# Altium project Master board.PrjPcb
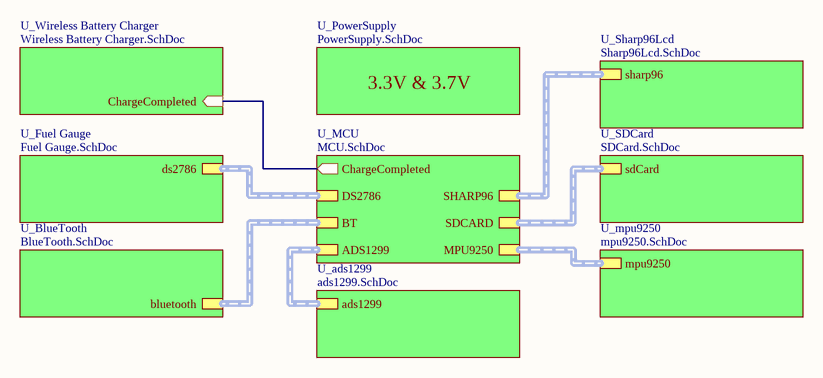
[diagram p0: Top Layer.SchDoc]
10 sheets, 102 parts. Net scope: hierarchical (ports join the sheet entries above them; power ports are global).
Board file: ArrowMasterBoard.PcbDoc
Sheets:
  Top Layer.SchDoc
    U_Wireless Battery Charger = Wireless Battery Charger.SchDoc
    U_Fuel Gauge = Fuel Gauge.SchDoc
    U_PowerSupply = PowerSupply.SchDoc
    U_MCU = MCU.SchDoc
    U_BlueTooth = BlueTooth.SchDoc
    U_mpu9250 = mpu9250.SchDoc
    U_SDCard = SDCard.SchDoc
    U_Sharp96Lcd = Sharp96Lcd.SchDoc
    U_ads1299 = ads1299.SchDoc

## Sheet Top Layer.SchDoc
size A4

### Sub-sheets
U_ads1299 = ads1299.SchDoc: ads1299 (harness ads1299)
U_BlueTooth = BlueTooth.SchDoc: bluetooth (harness bluetooth)
U_Fuel Gauge = Fuel Gauge.SchDoc: ds2786 (harness ds2786)
U_MCU = MCU.SchDoc: ADS1299 (harness ads1299), MPU9250 (harness mpu9250), DS2786 (harness ds2786), SHARP96 (harness sharp96), SDCARD (harness sdCard), BT (harness bluetooth), ChargeCompleted (out)
U_mpu9250 = mpu9250.SchDoc: mpu9250 (harness mpu9250)
U_PowerSupply = PowerSupply.SchDoc: no entries
U_SDCard = SDCard.SchDoc: sdCard (harness sdCard)
U_Sharp96Lcd = Sharp96Lcd.SchDoc: sharp96 (harness sharp96)
U_Wireless Battery Charger = Wireless Battery Charger.SchDoc: ChargeCompleted (in)

### Nets
P4.7: sheet U_Wireless Battery Charger/ChargeCompleted, sheet U_MCU/ChargeCompleted

### Buses and harness runs
harness sheet U_ads1299/ads1299 = sheet U_MCU/ADS1299
harness sheet U_BlueTooth/bluetooth = sheet U_MCU/BT
harness sheet U_Fuel Gauge/ds2786 = sheet U_MCU/DS2786
harness sheet U_MCU/MPU9250 = sheet U_mpu9250/mpu9250
harness sheet U_MCU/SDCARD = sheet U_SDCard/sdCard
harness sheet U_MCU/SHARP96 = sheet U_Sharp96Lcd/sharp96

### Notes on the sheet
- 3.3V & 3.7V

## Sheet Wireless Battery Charger.SchDoc
size A4; PageSetup: Record=PageOptions|CenterHorizontal=True|CenterVertical=True|PrintScale=0.97|XCorrection=1.00|YCorrection=1.00|PrintKind=2|BorderSize=5000000|LeftOffset=0|BottomOffset=0|Orientation=2|PaperLength=1000|PaperWidth=1000|Scale=100|PaperSource=7|PrintQuality=-3|MediaType=1|DitherType=10|PrintScaleMode=1|PaperKind=A4|PaperIndex=9
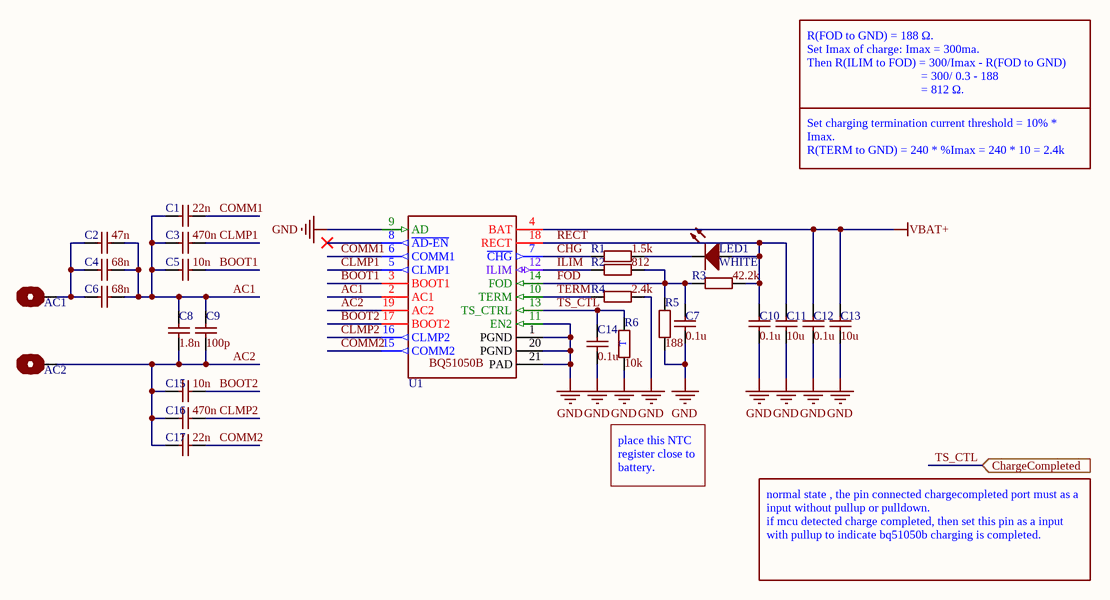
[diagram p1: Wireless Battery Charger.SchDoc]

### Parts
AC1  Pad  [PAD]  (value not drawn)
AC2  Pad  [PAD]  (value not drawn)
C1  value 22n  [C0402_h]  (hidden comment: Capacitor)
C2  value 47n  [C0402_h]  (hidden comment: Capacitor)
C3  value 470n  [C0402_h]  (hidden comment: Capacitor)
C4  value 68n  [C0402_h]  (hidden comment: Capacitor)
C5  value 10n  [C0402_h]  (hidden comment: Capacitor)
C6  value 68n  [C0402_h]  (hidden comment: Capacitor)
C7  value 0.1u  [C0402_h]  (hidden comment: Capacitor)
C8  value 1.8n  [C0402_h]  (hidden comment: Capacitor)
C9  value 100p  [C0402_h]  (hidden comment: Capacitor)
C10  value 0.1u  [C0402_h]  (hidden comment: Capacitor)
C11  value 10u  [C0402_h]  (hidden comment: Capacitor)
C12  value 0.1u  [C0402_h]  (hidden comment: Capacitor)
C13  value 10u  [C0402_h]  (hidden comment: Capacitor)
C14  value 0.1u  [C0402_h]  (hidden comment: Capacitor)
C15  value 10n  [C0402_h]  (hidden comment: Capacitor)
C16  value 470n  [C0402_h]  (hidden comment: Capacitor)
C17  value 22n  [C0402_h]  (hidden comment: Capacitor)
LED1  Color: WHITE  [LED0805]  (hidden comment: LED)
R1  value 1.5k  [R0402]  (hidden comment: Register)
R2  value 812  [R0402]  (hidden comment: Register)
R3  value 42.2k  [R0402]  (hidden comment: Register)
R4  value 2.4k  [R0402]  (hidden comment: Register)
R5  value 188  [R0402]  (hidden comment: Register)
R6  value 10k  [NTC]  (hidden comment: Register)
U1  BQ51050BRHLR  [VQFN-20]  (value not drawn)

### Ports
ChargeCompleted (in)

### Nets
GND: C7.2 C10.1 C11.1 C12.1 C13.1 C14.1 R4.2 R5.2 R6.1 U1.1(PGND) U1.9(AD) U1.11(EN2) U1.20(PGND) U1.21(PAD)
VBAT+: C12.2 C13.2 U1.4(BAT)
AC1: C1.1 C2.2 C3.1 C4.2 C5.1 C6.2 C8.2 C9.2 U1.2(AC1)
AC2: AC2.1 C8.1 C9.1 C15.1 C16.1 C17.1 U1.19(AC2)
BOOT1: C5.2 U1.3(BOOT1)
BOOT2: C15.2 U1.17(BOOT2)
CHG: R1.2 U1.7(~{CHG})
CLMP1: C3.2 U1.5(CLMP1)
CLMP2: C16.2 U1.16(CLMP2)
COMM1: C1.2 U1.6(COMM1)
COMM2: C17.2 U1.15(COMM2)
FOD: C7.1 R2.2 R3.1 R5.1 U1.14(FOD)
ILIM: R2.1 U1.12(ILIM)
RECT: C10.2 C11.2 LED1.1(A) R3.2 U1.18(RECT)
TERM: R4.1 U1.10(TERM)
TS_CTL: C14.2 R6.2 U1.13(TS_CTRL) ; port ChargeCompleted  [project net P4.7]
NetAC1_1: AC1.1 C2.1 C4.1 C6.1
NetLED1_2: LED1.2(K) R1.1

Not connected (* = marked no-connect by the designer): U1 8(~{AD-EN})*

### Notes on the sheet
- R(FOD to GND) = 188 Ω.
  Set Imax of charge: Imax = 300ma.
  Then R(ILIM to FOD) = 300/Imax - R(FOD to GND)
  = 300/ 0.3 - 188
  = 812 Ω.
- Set charging termination current threshold = 10% * Imax.
  R(TERM to GND) = 240 * %Imax = 240 * 10 = 2.4k
- place this NTC register close to battery.
- normal state , the pin connected chargecompleted port must as a input without pullup or pulldown.
  if mcu detected charge completed, then set this pin as a input with pullup to indicate bq51050b charging is completed.
- (in symbol BQ51050BRHLR) BQ51050B
- (in symbol 热敏电阻) T

### Library data of the parts
C1-C17 = 贴片电容-无极性: VDC: 10V; Published: 8-Jun-2000; LatestRevisionDate: 17-Jul-2002; LatestRevisionNote: Re-released for DXP Platform.; PackageReference: RAD-0.3; Publisher: Altium Limited; PackageDescription: Radial Cap, Thru-Hole; 2 Leads; 0.3 in Pin Spacing
R1-R5 = 贴片电阻
R6 = 热敏电阻
U1 = BQ51050BRHLR: 4.2V Li-Ion Wireless Battery Charger, receiver; Manufacturer: Texas Instruments; CompType: IC; PIN_COUNT: 21; PartNumber: BQ51050BRHLR; PackageReference: RHL0020A; MountType: SMT; RoHS: Y; RefDes: RefDes; Type: DEV; Value: Value
LED1 = LED: Published: 8-Jun-2000; LatestRevisionDate: 08-Jul-2005; LatestRevisionNote: Mech Layer 1 removed.; PackageReference: LED-0; Publisher: Altium Limited; PackageDescription: LED; 2 Leads

## Sheet Fuel Gauge.SchDoc
size A4; PageSetup: Record=PageOptions|CenterHorizontal=True|CenterVertical=True|PrintScale=0.97|XCorrection=1.00|YCorrection=1.00|PrintKind=2|BorderSize=5000000|LeftOffset=0|BottomOffset=0|Orientation=2|PaperLength=1000|PaperWidth=1000|Scale=100|PaperSource=7|PrintQuality=-3|MediaType=1|DitherType=10|PrintScaleMode=1|PaperKind=A4|PaperIndex=9
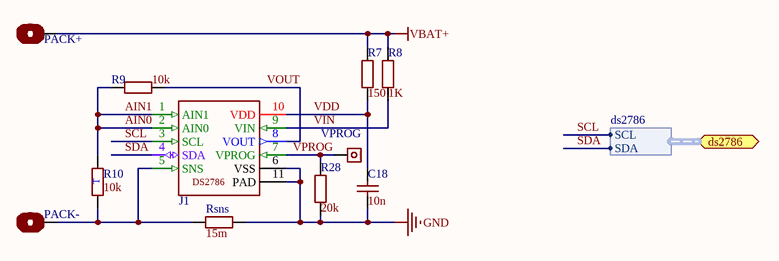
[diagram p2: Fuel Gauge.SchDoc]

### Parts
C18  value 10n  [C0402_h]  (hidden comment: Capacitor)
J1  DS2786G+  [TDFN-EP-10]  (value not drawn)
PACK+  Pad  [PAD]  (value not drawn)
PACK-  Pad  [PAD]  (value not drawn)
R7  value 150  [R0402]  (hidden comment: Register)
R8  value 1K  [R0402]  (hidden comment: Register)
R9  value 10k  [R0402]  (hidden comment: Register)
R10  value 10k  [NTC]  (hidden comment: Register)
R28  value 20k  [R0402]  (hidden comment: Register)
Rsns  value 15m  [R0805]  (hidden comment: Register)
VPROG  TestPoint  [TestPoint]  (value not drawn)

### Ports
ds2786 (harness ds2786)

### Harnesses
ds2786: SCL, SDA

### Nets
GND: C18.1 J1.6(VSS) J1.11(PAD) R28.2 Rsns.2
VBAT+: PACK+.1 R7.1 R8.1
AIN0: J1.1(AIN1) J1.2(AIN0) R9.2 R10.2  [also labelled AIN1]
SCL: J1.3(SCL) ; port ds2786.SCL  [project net MPU_SCL]
SDA: J1.4(SDA) ; port ds2786.SDA  [project net MPU_SDA]
VDD: C18.2 J1.10(VDD) R7.2
VIN: J1.9(VIN) R8.2
VOUT: J1.8(VOUT) R9.1
VPROG: J1.7(VPROG) R28.1 VPROG.1(test)
NetJ1_5: J1.5(SNS) PACK-.1 R10.1 Rsns.1

### Notes on the sheet
- (in symbol DS2786G+) DS2786
- (in symbol TestPoint) testpoint
- (in symbol 热敏电阻) T

### Library data of the parts
C18 = 贴片电容-无极性: VDC: 10V; Published: 8-Jun-2000; LatestRevisionDate: 17-Jul-2002; LatestRevisionNote: Re-released for DXP Platform.; PackageReference: RAD-0.3; Publisher: Altium Limited; PackageDescription: Radial Cap, Thru-Hole; 2 Leads; 0.3 in Pin Spacing
J1 = DS2786G+: Fuek Gauge; Voltage - Supply: 2.5 V ~ 5.5 V; Battery Type: Li-Ion, Li-Pol; Function: Fuel, Gas Gauge/Monitor; Vendor: Maxim Integrated Products; Battery Chemistry: Lithium-Ion (Li-Ion), Lithium-Polymer (Li-Pol); Packaging: Tube; Package / Case: 10-WFDFN Exposed Pad; Operating Temperature: -40??C ~ 85??C; DataSheet: http://datasheets.maxim-ic.com/en/ds/DS2786.pdf; DigiKeyPartNumber: DS2786G+-ND; Manufacturer_Part_Number: DS2786G+; Quantity_Available: 928; Mounting Type: Surface Mount; Supplier Device Package: 10-TDFN-EP (3x4); RefDes: RefDes; Type: DEV; Value: Value
R7-R9 R28 Rsns = 贴片电阻
R10 = 热敏电阻

## Sheet PowerSupply.SchDoc
size A4; PageSetup: Record=PageOptions|CenterHorizontal=True|CenterVertical=True|PrintScale=0.97|XCorrection=1.00|YCorrection=1.00|PrintKind=2|BorderSize=5000000|LeftOffset=0|BottomOffset=0|Orientation=2|PaperLength=1000|PaperWidth=1000|Scale=100|PaperSource=7|PrintQuality=-3|MediaType=1|DitherType=10|PrintScaleMode=1|PaperKind=A4|PaperIndex=9
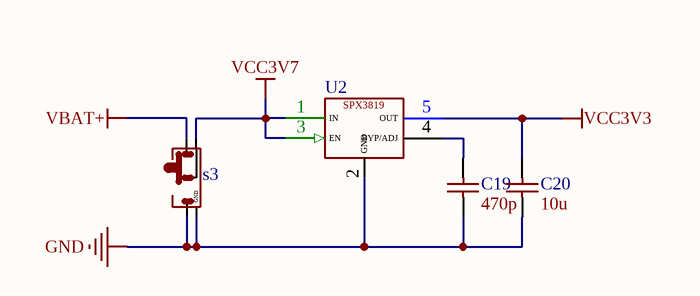
[diagram p3: PowerSupply.SchDoc]

### Parts
C19  value 470p  [C0402_h]  (hidden comment: Capacitor)
C20  value 10u  [C0402_h]  (hidden comment: Capacitor)
s3  switch  [侧动贴片开关]  (value not drawn)
U2  SPX3819  [SOT23-5]  (value not drawn)

### Nets
GND: C19.2 C20.2 s3.0(GND) s3.3(R) U2.2(GND)
VBAT+: s3.1(L)
VCC3V3: C20.1 U2.5(OUT)
VCC3V7: s3.2(mid) U2.1(IN) U2.3(EN)
NetC19_1: C19.1 U2.4(BYP/ADJ)

### Library data of the parts
C19 C20 = 贴片电容-无极性: VDC: 10V; Published: 8-Jun-2000; LatestRevisionDate: 17-Jul-2002; LatestRevisionNote: Re-released for DXP Platform.; PackageReference: RAD-0.3; Publisher: Altium Limited; PackageDescription: Radial Cap, Thru-Hole; 2 Leads; 0.3 in Pin Spacing
s3 = 拨动开关
U2 = SPX3819: 500mA, Low-Noise LDO Voltage Regulator

## Sheet MCU.SchDoc
size A4; PageSetup: Record=PageOptions|CenterHorizontal=True|CenterVertical=True|PrintScale=0.97|XCorrection=1.00|YCorrection=1.00|PrintKind=2|BorderSize=5000000|LeftOffset=0|BottomOffset=0|Orientation=2|PaperLength=1000|PaperWidth=1000|Scale=100|PaperSource=7|PrintQuality=-3|MediaType=1|DitherType=10|PrintScaleMode=1|PaperKind=A4|PaperIndex=9
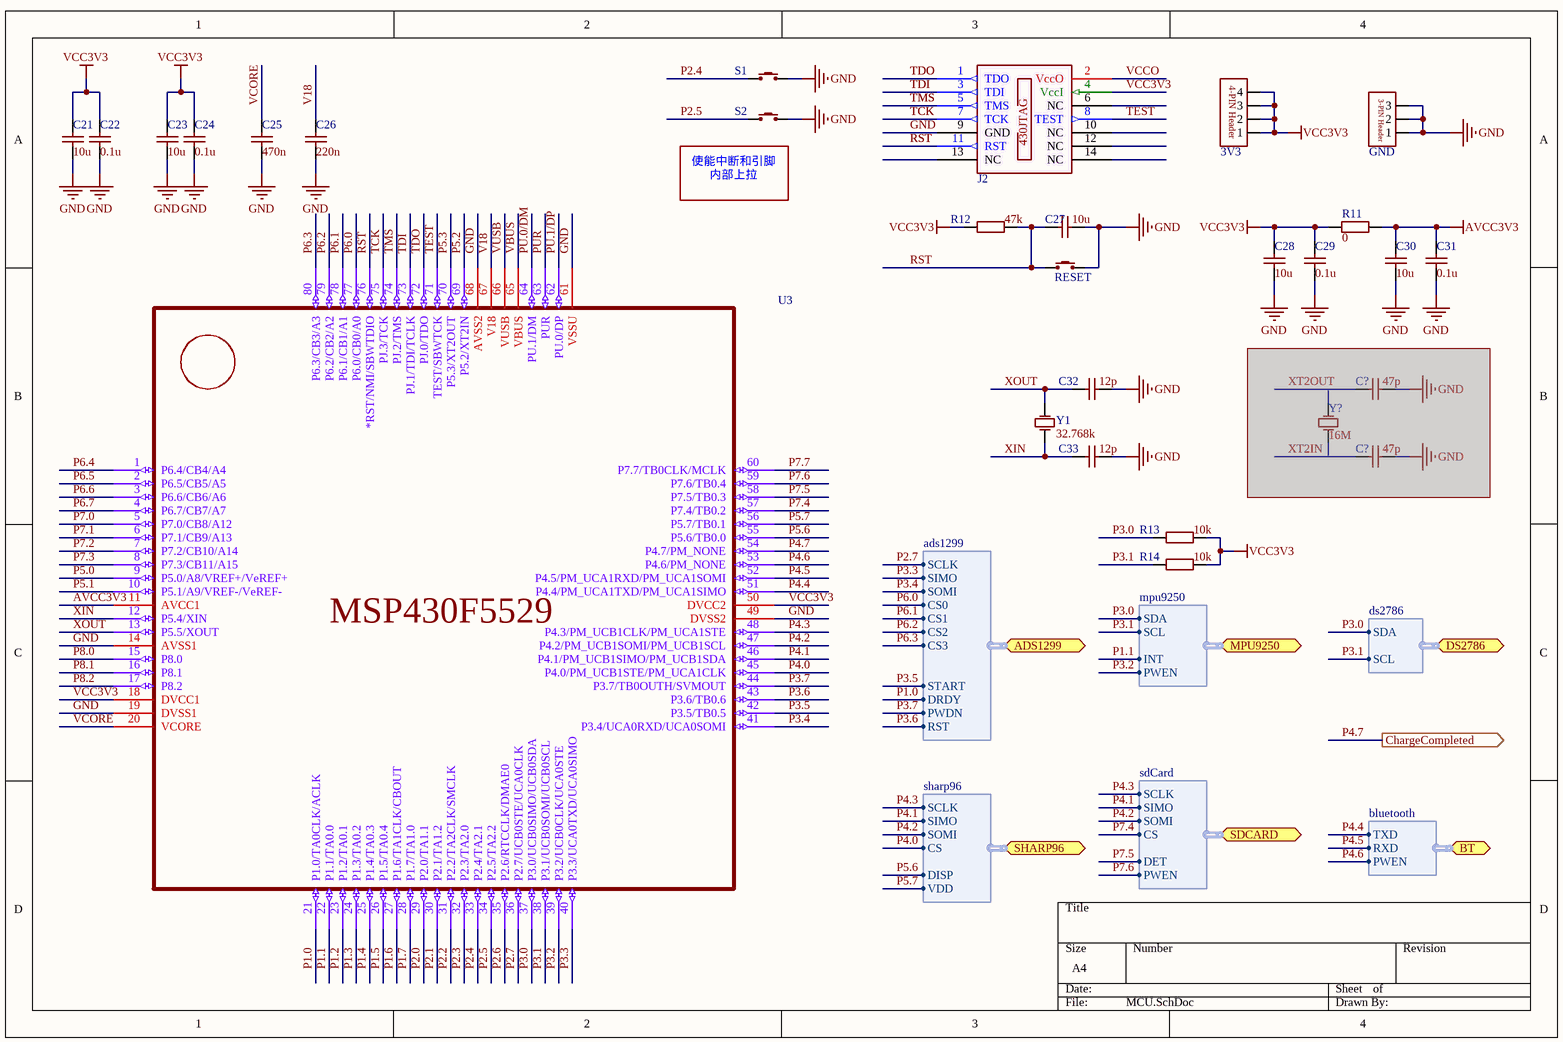
[diagram p4: MCU.SchDoc]

### Parts
(Parts that share a designator on the sheet are numbered #1, #2 ... from top to bottom, then left to right.)
3V3  Header 1X4  [排针1X4 2.54mm]  (value not drawn)
C21  value 10u  [C0402_h]  (hidden comment: Capacitor)
C22  value 0.1u  [C0402_h]  (hidden comment: Capacitor)
C23  value 10u  [C0402_h]  (hidden comment: Capacitor)
C24  value 0.1u  [C0402_h]  (hidden comment: Capacitor)
C25  value 470n  [C0402_h]  (hidden comment: Capacitor)
C26  value 220n  [C0402_h]  (hidden comment: Capacitor)
C27  value 10u  [C0402_h]  (hidden comment: Capacitor)
C28  value 10u  [C0402_h]  (hidden comment: Capacitor)
C29  value 0.1u  [C0402_h]  (hidden comment: Capacitor)
C30  value 10u  [C0402_h]  (hidden comment: Capacitor)
C31  value 0.1u  [C0402_h]  (hidden comment: Capacitor)
C32  value 12p  [C0402_h]  (hidden comment: Capacitor)
C33  value 12p  [C0402_h]  (hidden comment: Capacitor)
C?#1  value 47p  [C0402_h]  (hidden comment: Capacitor)  (masked out: inside a compile mask, not in the netlist)
C?#2  value 47p  [C0402_h]  (hidden comment: Capacitor)  (masked out: inside a compile mask, not in the netlist)
GND  Header1X3  [排针1X3 2.54mm]  (value not drawn)
J2  430JTAG_14  [IDC 2X7]  (value not drawn)
R11  value 0  [R0402]  (hidden comment: Register)
R12  value 47k  [R0402]  (hidden comment: Register)
R13  value 10k  [R0402]  (hidden comment: Register)
R14  value 10k  [R0402]  (hidden comment: Register)
RESET  switch  [贴片开关 6X4]  (value not drawn)
S1  switch  [贴片开关 6X4]  (value not drawn)
S2  switch  [贴片开关 6X4]  (value not drawn)
U3  MSP430F5529_PN_8  [LQFP-80]  (value not drawn)
Y1  value 32.768k  [手表晶振 3x8]  (hidden comment: 晶振)
Y?  value 16M  [手表晶振 3x8]  (hidden comment: 晶振)  (masked out: inside a compile mask, not in the netlist)

### Ports
ADS1299 (harness ads1299), BT (harness bluetooth), ChargeCompleted (out), DS2786 (harness ds2786), MPU9250 (harness mpu9250), SDCARD (harness sdCard), SHARP96 (harness sharp96)

### Harnesses
ads1299: SCLK, SIMO, SOMI, CS0, CS1, CS2, CS3, START, DRDY, PWDN, RST
mpu9250: SCL, SDA, INT, PWEN
sharp96: SCLK, SIMO, SOMI, CS, DISP, VDD
bluetooth: TXD, RXD, PWEN
ds2786: SDA, SCL
sdCard: SCLK, SIMO, SOMI, PWEN, CS, DET

### Nets
AVCC3V3: C30.1 C31.1 R11.1 U3.11(AVCC1)
GND: C21.1 C22.1 C23.1 C24.1 C25.1 C26.1 C27.2 C28.1 C29.1 C30.2 C31.2 C32.2 C33.2 GND.1 GND.2 GND.3 J2.9(GND) RESET.2 S1.2 S2.2 U3.14(AVSS1) U3.19(DVSS1) U3.49(DVSS2) U3.61(VSSU) U3.68(AVSS2)
VCC3V3: 3V3.1 3V3.2 3V3.3 3V3.4 C21.2 C22.2 C23.2 C24.2 C28.2 C29.2 J2.4(VccI) R11.2 R12.1 R13.2 R14.2 U3.18(DVCC1) U3.50(DVCC2)
P1.0: U3.21(P1.0/TA0CLK/ACLK) ; port ADS1299.DRDY  [project net DRDY]
P1.1: U3.22(P1.1/TA0.0) ; port MPU9250.INT  [project net MPU_INT]
P1.2: U3.23(P1.2/TA0.1)
P1.3: U3.24(P1.3/TA0.2)
P1.4: U3.25(P1.4/TA0.3)
P1.5: U3.26(P1.5/TA0.4)
P1.6: U3.27(P1.6/TA1CLK/CBOUT)
P1.7: U3.28(P1.7/TA1.0)
P2.0: U3.29(P2.0/TA1.1)
P2.1: U3.30(P2.1/TA1.2)
P2.2: U3.31(P2.2/TA2CLK/SMCLK)
P2.3: U3.32(P2.3/TA2.0)
P2.4: S1.1 U3.33(P2.4/TA2.1)
P2.5: S2.1 U3.34(P2.5/TA2.2)
P2.6: U3.35(P2.6/RTCCLK/DMAE0)
P2.7: U3.36(P2.7/UCB0STE/UCA0CLK) ; port ADS1299.SCLK
P3.0: R13.1 U3.37(P3.0/UCB0SIMO/UCB0SDA) ; port MPU9250.SDA, port DS2786.SDA  [project net MPU_SDA]
P3.1: R14.1 U3.38(P3.1/UCB0SOMI/UCB0SCL) ; port MPU9250.SCL, port DS2786.SCL  [project net MPU_SCL]
P3.2: U3.39(P3.2/UCB0CLK/UCA0STE) ; port MPU9250.PWEN  [project net MPU_PWEN]
P3.3: U3.40(P3.3/UCA0TXD/UCA0SIMO) ; port ADS1299.SIMO
P3.4: U3.41(P3.4/UCA0RXD/UCA0SOMI) ; port ADS1299.SOMI
P3.5: U3.42(P3.5/TB0.5) ; port ADS1299.START
P3.6: U3.43(P3.6/TB0.6) ; port ADS1299.RST
P3.7: U3.44(P3.7/TB0OUTH/SVMOUT) ; port ADS1299.PWDN
P4.0: U3.45(P4.0/PM_UCB1STE/PM_UCA1CLK) ; port SHARP96.CS
P4.1: U3.46(P4.1/PM_UCB1SIMO/PM_UCB1SDA) ; port SHARP96.SIMO, port SDCARD.SIMO
P4.2: U3.47(P4.2/PM_UCB1SOMI/PM_UCB1SCL) ; port SHARP96.SOMI, port SDCARD.SOMI
P4.3: U3.48(P4.3/PM_UCB1CLK/PM_UCA1STE) ; port SHARP96.SCLK, port SDCARD.SCLK
P4.4: U3.51(P4.4/PM_UCA1TXD/PM_UCA1SIMO) ; port BT.TXD  [project net BT_RXD]
P4.5: U3.52(P4.5/PM_UCA1RXD/PM_UCA1SOMI) ; port BT.RXD  [project net BT_TXD]
P4.6: U3.53(P4.6/PM_NONE) ; port BT.PWEN  [project net BT_PWEN]
P4.7: U3.54(P4.7/PM_NONE) ; port ChargeCompleted
P5.0: U3.9(P5.0/A8/VREF+/VeREF+)
P5.1: U3.10(P5.1/A9/VREF-/VeREF-)
P5.2: U3.69(P5.2/XT2IN)
P5.3: U3.70(P5.3/XT2OUT)
P5.6: U3.55(P5.6/TB0.0) ; port SHARP96.DISP
P5.7: U3.56(P5.7/TB0.1) ; port SHARP96.VDD
P6.0: U3.77(P6.0/CB0/A0) ; port ADS1299.CS0  [project net CS0]
P6.1: U3.78(P6.1/CB1/A1) ; port ADS1299.CS1  [project net CS1]
P6.2: U3.79(P6.2/CB2/A2) ; port ADS1299.CS2  [project net CS2]
P6.3: U3.80(P6.3/CB3/A3) ; port ADS1299.CS3  [project net CS3]
P6.4: U3.1(P6.4/CB4/A4)
P6.5: U3.2(P6.5/CB5/A5)
P6.6: U3.3(P6.6/CB6/A6)
P6.7: U3.4(P6.7/CB7/A7)
P7.0: U3.5(P7.0/CB8/A12)
P7.1: U3.6(P7.1/CB9/A13)
P7.2: U3.7(P7.2/CB10/A14)
P7.3: U3.8(P7.3/CB11/A15)
P7.4: U3.57(P7.4/TB0.2) ; port SDCARD.CS
P7.5: U3.58(P7.5/TB0.3) ; port SDCARD.DET
P7.6: U3.59(P7.6/TB0.4) ; port SDCARD.PWEN
P7.7: U3.60(P7.7/TB0CLK/MCLK)
P8.0: U3.15(P8.0)
P8.1: U3.16(P8.1)
P8.2: U3.17(P8.2)
PU.0/DM: U3.64(PU.1/DM)
PU.1/DP: U3.62(PU.0/DP)
PUR: U3.63(PUR)
RST: C27.1 J2.11(RST) R12.2 RESET.1 U3.76(*RST/NMI/SBWTDIO)
TCK: J2.7(TCK) U3.75(PJ.3/TCK)
TDI: J2.3(TDI) U3.73(PJ.1/TDI/TCLK)
TDO: J2.1(TDO) U3.72(PJ.0/TDO)
TEST: J2.8(TEST) U3.71(TEST/SBWTCK)
TMS: J2.5(TMS) U3.74(PJ.2/TMS)
V18: C26.2 U3.67(V18)
VBUS: U3.65(VBUS)
VCCO: J2.2(VccO)
VCORE: C25.2 U3.20(VCORE)
VUSB: U3.66(VUSB)
XIN: C33.1 U3.12(P5.4/XIN) Y1.2(OSC2)
XOUT: C32.1 U3.13(P5.5/XOUT) Y1.1(OSC1)

Not connected (* = marked no-connect by the designer): J2 6(NC) 10(NC) 12(NC) 13(NC) 14(NC)

### Notes on the sheet
- (near S2) 使能中断和引脚内部上拉
- (in symbol 430JTAG_14) 430JTAG
- (in symbol 排针/排母 1X3) 3-PIN Header
- (in symbol 排针/排母 1X4) 4-PIN Header

### Library data of the parts
3V3 = 排针/排母 1X4: Header, 4-Pin; LatestRevisionDate: 17-Jul-2002; LatestRevisionNote: Re-released for DXP Platform.; Publisher: Altium Limited
C21-C33 C?#1 C?#2 = 贴片电容-无极性: VDC: 10V; Published: 8-Jun-2000; LatestRevisionDate: 17-Jul-2002; LatestRevisionNote: Re-released for DXP Platform.; PackageReference: RAD-0.3; Publisher: Altium Limited; PackageDescription: Radial Cap, Thru-Hole; 2 Leads; 0.3 in Pin Spacing
GND = 排针/排母 1X3: Header, 3-Pin; LatestRevisionDate: 17-Jul-2002; LatestRevisionNote: Re-released for DXP Platform.; Publisher: Altium Limited
J2 = 430JTAG_14: JTAG FOR MSP430 14-PINS
R11-R14 = 贴片电阻
RESET S1 S2 = 按键开关: Published: 24-Mar-1999; LatestRevisionDate: 17-Jul-2002; LatestRevisionNote: Re-released for DXP Platform.; PackageReference: SPST-2; Publisher: Altium Limited; PackageDescription: Switch; 2 Leads
U3 = MSP430F5529_PN_8: Imported; Manufacturer_Part_Number: msp430f5529_pn_80; Vendor: Texas Instruments; PACKAGE_DESIGNATOR: PN; PIN_COUNT: 80; FAMILY_NAME: 5 Series; INDUSTRY_STD_PKG_TYPE: LQFP; GENERIC_PART_NUMBER: MSP430F5529; Datasheet URL: http://www.ti.com/lit/gpn/MSP430F5529; Manufacturer: Texas Instruments; RefDes: RefDes; Type: DEV; Value: Value

## Sheet BlueTooth.SchDoc
size A4; PageSetup: Record=PageOptions|CenterHorizontal=True|CenterVertical=True|PrintScale=0.97|XCorrection=1.00|YCorrection=1.00|PrintKind=2|BorderSize=5000000|LeftOffset=0|BottomOffset=0|Orientation=2|PaperLength=1000|PaperWidth=1000|Scale=100|PaperSource=7|PrintQuality=-3|MediaType=1|DitherType=10|PrintScaleMode=1|PaperKind=A4|PaperIndex=9
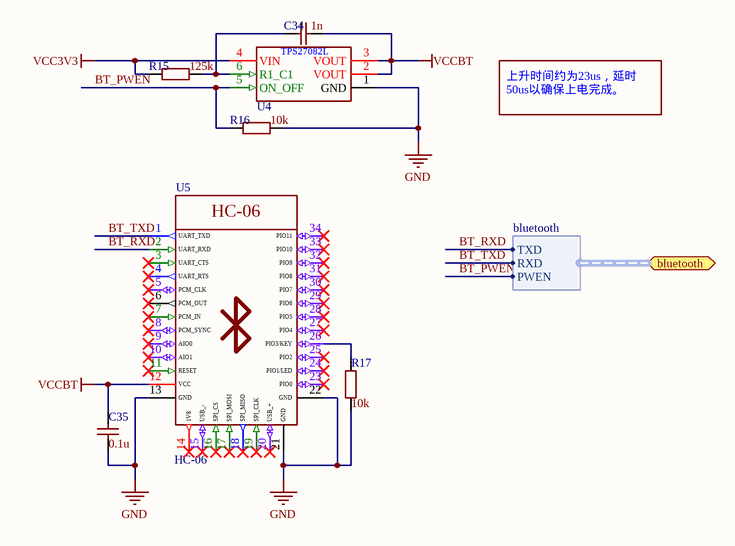
[diagram p5: BlueTooth.SchDoc]

### Parts
C34  value 1n  [C0402_h]  (hidden comment: Capacitor)
C35  value 0.1u  [C0402_h]  (hidden comment: Capacitor)
R15  value 125k  [R0402]  (hidden comment: Register)
R16  value 10k  [R0402]  (hidden comment: Register)
R17  value 10k  [R0402]  (hidden comment: Register)
U4  TPS27082L  [SOT23-6]  (value not drawn)
U5  HC-06  [HC-0X-bluetooth]

### Ports
bluetooth (harness bluetooth)

### Harnesses
bluetooth: TXD, RXD, PWEN

### Nets
GND: C35.1 R16.2 R17.1 U4.1(GND) U5.13(GND) U5.21(GND) U5.22(GND)
VCC3V3: R15.1 U4.4(VIN)
VCCBT: C34.2 C35.2 U4.2(VOUT) U4.3(VOUT) U5.12(VCC)
BT_PWEN: R16.1 U4.5(ON_OFF) ; port bluetooth.PWEN
BT_RXD: U5.2(UART_RXD) ; port bluetooth.TXD
BT_TXD: U5.1(UART_TXD) ; port bluetooth.RXD
NetC34_1: C34.1 R15.2 U4.6(R1_C1)
NetR17_2: R17.2 U5.26(PIO3/KEY)

Not connected (* = marked no-connect by the designer): U5 3(UART_CTS)* 4(UART_RTS)* 5(PCM_CLK)* 6(PCM_OUT)* 7(PCM_IN)* 8(PCM_SYNC)* 9(AIO0)* 10(AIO1)* 11(RESET)* 14(1V8)* 15(USB_-)* 16(SPI_CS)* 17(SPI_MOSI)* 18(SPI_MISO)* 19(SPI_CLK)* 20(USB_+)* 23(PIO0)* 24(PIO1/LED)* 25(PIO2)* 27(PIO4)* 28(PIO5)* 29(PIO6)* 30(PIO7)* 31(PIO8)* 32(PIO9)* 33(PIO10)* 34(PIO11)*

### Notes on the sheet
- 上升时间约为23us，延时50us以确保上电完成。

### Library data of the parts
C34 C35 = 贴片电容-无极性: VDC: 10V; Published: 8-Jun-2000; LatestRevisionDate: 17-Jul-2002; LatestRevisionNote: Re-released for DXP Platform.; PackageReference: RAD-0.3; Publisher: Altium Limited; PackageDescription: Radial Cap, Thru-Hole; 2 Leads; 0.3 in Pin Spacing
R15-R17 = 贴片电阻
U4 = TPS27082LDDCR: load switch; Manufacturer: Texas Instruments; CompType: IC; PIN_COUNT: 6; PartNumber: TPS27082LDDC; PackageReference: DDC0006A; MountType: SMT; RoHS: Y; RefDes: RefDes; Type: DEV; Value: Value
U5 = HC-06 Bluetooth

## Sheet mpu9250.SchDoc
size A4; PageSetup: Record=PageOptions|CenterHorizontal=True|CenterVertical=True|PrintScale=0.97|XCorrection=1.00|YCorrection=1.00|PrintKind=2|BorderSize=5000000|LeftOffset=0|BottomOffset=0|Orientation=2|PaperLength=1000|PaperWidth=1000|Scale=100|PaperSource=7|PrintQuality=-3|MediaType=1|DitherType=10|PrintScaleMode=1|PaperKind=A4|PaperIndex=9
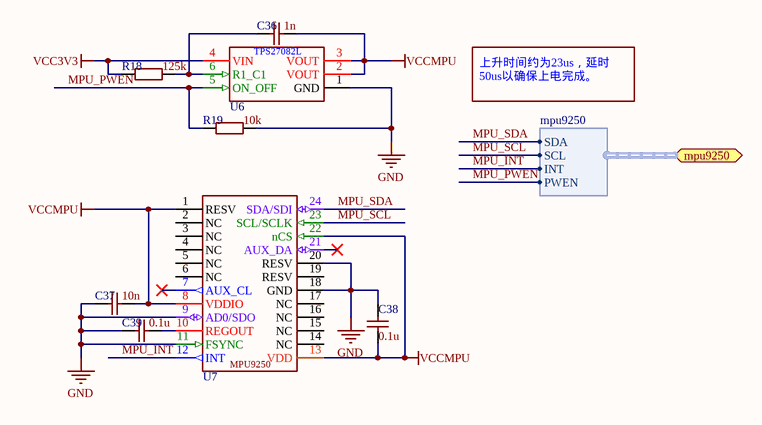
[diagram p6: mpu9250.SchDoc]

### Parts
C36  value 1n  [C0402_h]  (hidden comment: Capacitor)
C37  value 10n  [C0402_h]  (hidden comment: Capacitor)
C38  value 0.1u  [C0402_h]  (hidden comment: Capacitor)
C39  value 0.1u  [C0402_h]  (hidden comment: Capacitor)
R18  value 125k  [R0402]  (hidden comment: Register)
R19  value 10k  [R0402]  (hidden comment: Register)
U6  TPS27082L  [SOT23-6]  (value not drawn)
U7  MPU9250  [QFN24 3.0X3.0]  (value not drawn)

### Ports
mpu9250 (harness mpu9250)

### Harnesses
mpu9250: SDA, SCL, INT, PWEN

### Nets
GND: C37.1 C38.2 C39.1 R19.2 U6.1(GND) U7.9(AD0/SDO) U7.11(FSYNC) U7.18(GND) U7.20(RESV)
VCC3V3: R18.1 U6.4(VIN)
VCCMPU: C36.2 C37.2 C38.1 U6.2(VOUT) U6.3(VOUT) U7.1(RESV) U7.8(VDDIO) U7.13(VDD) U7.22(nCS)
MPU_INT: U7.12(INT) ; port mpu9250.INT
MPU_PWEN: R19.1 U6.5(ON_OFF) ; port mpu9250.PWEN
MPU_SCL: U7.23(SCL/SCLK) ; port mpu9250.SCL
MPU_SDA: U7.24(SDA/SDI) ; port mpu9250.SDA
NetC36_1: C36.1 R18.2 U6.6(R1_C1)
NetC39_2: C39.2 U7.10(REGOUT)

Not connected (* = marked no-connect by the designer): U7 2(NC) 3(NC) 4(NC) 5(NC) 6(NC) 7(AUX_CL)* 14(NC) 15(NC) 16(NC) 17(NC) 19(RESV) 21(AUX_DA)*

### Notes on the sheet
- 上升时间约为23us，延时50us以确保上电完成。

### Library data of the parts
C36-C39 = 贴片电容-无极性: VDC: 10V; Published: 8-Jun-2000; LatestRevisionDate: 17-Jul-2002; LatestRevisionNote: Re-released for DXP Platform.; PackageReference: RAD-0.3; Publisher: Altium Limited; PackageDescription: Radial Cap, Thru-Hole; 2 Leads; 0.3 in Pin Spacing
R18 R19 = 贴片电阻
U6 = TPS27082LDDCR: as U4 on sheet BlueTooth; PartNumber: TPS27082LDDC; PackageReference: DDC0006A; MountType: SMT; RoHS: Y; RefDes: RefDes; Type: DEV; Value: Value
U7 = MPU9250: 9-axis MotionTracking Sensor

## Sheet SDCard.SchDoc
size A4; PageSetup: Record=PageOptions|CenterHorizontal=True|CenterVertical=True|PrintScale=0.97|XCorrection=1.00|YCorrection=1.00|PrintKind=2|BorderSize=5000000|LeftOffset=0|BottomOffset=0|Orientation=2|PaperLength=1000|PaperWidth=1000|Scale=100|PaperSource=7|PrintQuality=-3|MediaType=1|DitherType=10|PrintScaleMode=1|PaperKind=A4|PaperIndex=9
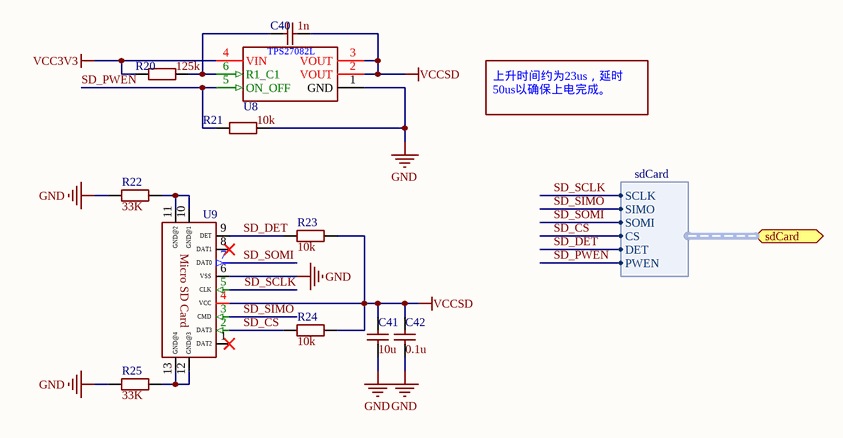
[diagram p7: SDCard.SchDoc]

### Parts
C40  value 1n  [C0402_h]  (hidden comment: Capacitor)
C41  value 10u  [C0402_h]  (hidden comment: Capacitor)
C42  value 0.1u  [C0402_h]  (hidden comment: Capacitor)
R20  value 125k  [R0402]  (hidden comment: Register)
R21  value 10k  [R0402]  (hidden comment: Register)
R22  value 33K  [R0402]  (hidden comment: Register)
R23  value 10k  [R0402]  (hidden comment: Register)
R24  value 10k  [R0402]  (hidden comment: Register)
R25  value 33K  [R0402]  (hidden comment: Register)
U8  TPS27082L  [SOT23-6]  (value not drawn)
U9  MicroSD  [MicroSD]  (value not drawn)

### Ports
sdCard (harness sdCard)

### Harnesses
sdCard: SCLK, SIMO, SOMI, CS, DET, PWEN

### Nets
GND: C41.1 C42.1 R21.1 R22.1 R25.1 U8.1(GND) U9.6(VSS)
VCC3V3: R20.1 U8.4(VIN)
VCCSD: C40.2 C41.2 C42.2 R23.2 R24.2 U8.2(VOUT) U8.3(VOUT) U9.4(VCC)
SD_CS: R24.1 U9.2(DAT3) ; port sdCard.CS  [project net P7.4]
SD_DET: R23.1 U9.9(DET) ; port sdCard.DET  [project net P7.5]
SD_PWEN: R21.2 U8.5(ON_OFF) ; port sdCard.PWEN  [project net P7.6]
SD_SCLK: U9.5(CLK) ; port sdCard.SCLK  [project net P4.3]
SD_SIMO: U9.3(CMD) ; port sdCard.SIMO  [project net P4.1]
SD_SOMI: U9.7(DAT0) ; port sdCard.SOMI  [project net P4.2]
NetC40_1: C40.1 R20.2 U8.6(R1_C1)
NetR22_2: R22.2 U9.10(GND@1) U9.11(GND@2)
NetR25_2: R25.2 U9.12(GND@3) U9.13(GND@4)

Not connected (* = marked no-connect by the designer): U9 1(DAT2)* 8(DAT1)*

### Notes on the sheet
- 上升时间约为23us，延时50us以确保上电完成。

### Library data of the parts
C40-C42 = 贴片电容-无极性: VDC: 10V; Published: 8-Jun-2000; LatestRevisionDate: 17-Jul-2002; LatestRevisionNote: Re-released for DXP Platform.; PackageReference: RAD-0.3; Publisher: Altium Limited; PackageDescription: Radial Cap, Thru-Hole; 2 Leads; 0.3 in Pin Spacing
R20-R25 = 贴片电阻
U8 = TPS27082LDDCR: as U4 on sheet BlueTooth; PartNumber: TPS27082LDDC; PackageReference: DDC0006A; MountType: SMT; RoHS: Y; RefDes: RefDes; Type: DEV; Value: Value
U9 = Micro SD Card

## Sheet Sharp96Lcd.SchDoc
size A4; PageSetup: Record=PageOptions|CenterHorizontal=True|CenterVertical=True|PrintScale=0.97|XCorrection=1.00|YCorrection=1.00|PrintKind=2|BorderSize=5000000|LeftOffset=0|BottomOffset=0|Orientation=2|PaperLength=1000|PaperWidth=1000|Scale=100|PaperSource=7|PrintQuality=-3|MediaType=1|DitherType=10|PrintScaleMode=1|PaperKind=A4|PaperIndex=9
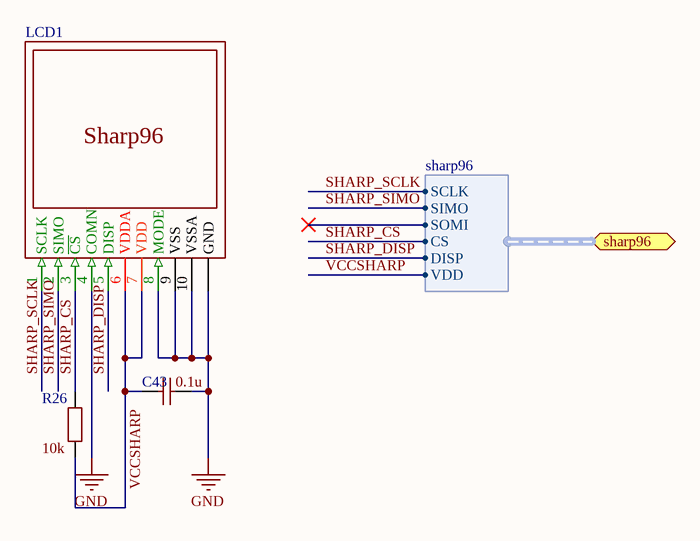
[diagram p8: Sharp96Lcd.SchDoc]

### Parts
C43  value 0.1u  [C0402_h]  (hidden comment: Capacitor)
LCD1  sharp96  [Sharp96]  (value not drawn)
R26  value 10k  [R0402]  (hidden comment: Register)

### Ports
sharp96 (harness sharp96)

### Harnesses
sharp96: SCLK, SIMO, SOMI, CS, DISP, VDD

### Nets
GND: C43.2 LCD1.0(GND) LCD1.4(COMN) LCD1.8(MODE) LCD1.9(VSS) LCD1.10(VSSA)
SHARP_CS: LCD1.3(~{CS}) R26.2 ; port sharp96.CS  [project net P4.0]
SHARP_DISP: LCD1.5(DISP) ; port sharp96.DISP  [project net P5.6]
SHARP_SCLK: LCD1.1(SCLK) ; port sharp96.SCLK  [project net P4.3]
SHARP_SIMO: LCD1.2(SIMO) ; port sharp96.SIMO  [project net P4.1]
VCCSHARP: C43.1 LCD1.6(VDDA) LCD1.7(VDD) R26.1 ; port sharp96.VDD  [project net P5.7]

### Notes on the sheet
- (in symbol LCD_Sharp96) Sharp96

### Library data of the parts
C43 = 贴片电容-无极性: VDC: 10V; Published: 8-Jun-2000; LatestRevisionDate: 17-Jul-2002; LatestRevisionNote: Re-released for DXP Platform.; PackageReference: RAD-0.3; Publisher: Altium Limited; PackageDescription: Radial Cap, Thru-Hole; 2 Leads; 0.3 in Pin Spacing
LCD1 = LCD_Sharp96: sharp96 lcd, 96x96
R26 = 贴片电阻

## Sheet ads1299.SchDoc
size A4; PageSetup: Record=PageOptions|CenterHorizontal=True|CenterVertical=True|PrintScale=0.97|XCorrection=1.00|YCorrection=1.00|PrintKind=2|BorderSize=5000000|LeftOffset=0|BottomOffset=0|Orientation=2|PaperLength=1000|PaperWidth=1000|Scale=100|PaperSource=7|PrintQuality=-3|MediaType=1|DitherType=10|PrintScaleMode=1|PaperKind=A4|PaperIndex=9
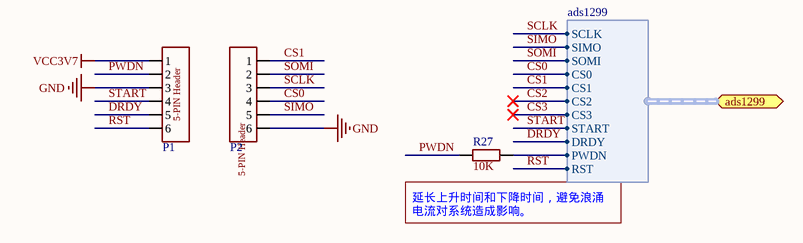
[diagram p9: ads1299.SchDoc]

### Parts
P1  Header 6  [排母1X6 2.54MM]  (value not drawn)
P2  Header 6  [排母1X6 2.54MM]  (value not drawn)
R27  value 10K  [R0402]  (hidden comment: Register)

### Ports
ads1299 (harness ads1299)

### Harnesses
ads1299: SCLK, SIMO, SOMI, CS0, CS1, CS2, CS3, START, DRDY, PWDN, RST

### Nets
GND: P1.3 P2.6
VCC3V7: P1.1
CS0: P2.4 ; port ads1299.CS0
CS1: P2.1 ; port ads1299.CS1
DRDY: P1.5 ; port ads1299.DRDY
P3.7: R27.2 ; port ads1299.PWDN
PWDN: P1.2 R27.1
RST: P1.6 ; port ads1299.RST  [project net P3.6]
SCLK: P2.3 ; port ads1299.SCLK  [project net P2.7]
SIMO: P2.5 ; port ads1299.SIMO  [project net P3.3]
SOMI: P2.2 ; port ads1299.SOMI  [project net P3.4]
START: P1.4 ; port ads1299.START  [project net P3.5]

### Notes on the sheet
- (near R27) 延长上升时间和下降时间，避免浪涌电流对系统造成影响。
- (in symbol 排针/排母 1X6) 5-PIN Header

### Library data of the parts
P1 P2 = 排针/排母 1X6: Header, 6-Pin; LatestRevisionDate: 17-Jul-2002; LatestRevisionNote: Re-released for DXP Platform.; Publisher: Altium Limited
R27 = 贴片电阻

## Nets that join several sheets
GND: Wireless Battery Charger (14 pins), Fuel Gauge (5 pins), PowerSupply (5 pins), MCU (25 pins), BlueTooth (7 pins), mpu9250 (9 pins), SDCard (7 pins), Sharp96Lcd (6 pins), ads1299 (P1.3 P2.6)
VBAT+: Wireless Battery Charger (C12.2 C13.2 U1.4), Fuel Gauge (PACK+.1 R7.1 R8.1), PowerSupply (s3.1)
VCC3V3: PowerSupply (C20.1 U2.5), MCU (17 pins), BlueTooth (R15.1 U4.4), mpu9250 (R18.1 U6.4), SDCard (R20.1 U8.4)
VCC3V7: PowerSupply (s3.2 U2.1 U2.3), ads1299 (P1.1)
BT_PWEN: MCU (U3.53), BlueTooth (R16.1 U4.5)
BT_RXD: MCU (U3.51), BlueTooth (U5.2)
BT_TXD: MCU (U3.52), BlueTooth (U5.1)
CS0: MCU (U3.77), ads1299 (P2.4)
CS1: MCU (U3.78), ads1299 (P2.1)
DRDY: MCU (U3.21), ads1299 (P1.5)
MPU_INT: MCU (U3.22), mpu9250 (U7.12)
MPU_PWEN: MCU (U3.39), mpu9250 (R19.1 U6.5)
MPU_SCL: Fuel Gauge (J1.3), MCU (R14.1 U3.38), mpu9250 (U7.23)
MPU_SDA: Fuel Gauge (J1.4), MCU (R13.1 U3.37), mpu9250 (U7.24)
P2.7: MCU (U3.36), ads1299 (P2.3)
P3.3: MCU (U3.40), ads1299 (P2.5)
P3.4: MCU (U3.41), ads1299 (P2.2)
P3.5: MCU (U3.42), ads1299 (P1.4)
P3.6: MCU (U3.43), ads1299 (P1.6)
P3.7: MCU (U3.44), ads1299 (R27.2)
P4.0: MCU (U3.45), Sharp96Lcd (LCD1.3 R26.2)
P4.1: MCU (U3.46), SDCard (U9.3), Sharp96Lcd (LCD1.2)
P4.2: MCU (U3.47), SDCard (U9.7)
P4.3: MCU (U3.48), SDCard (U9.5), Sharp96Lcd (LCD1.1)
P4.7: Wireless Battery Charger (C14.2 R6.2 U1.13), MCU (U3.54)
P5.6: MCU (U3.55), Sharp96Lcd (LCD1.5)
P5.7: MCU (U3.56), Sharp96Lcd (C43.1 LCD1.6 LCD1.7 R26.1)
P7.4: MCU (U3.57), SDCard (R24.1 U9.2)
P7.5: MCU (U3.58), SDCard (R23.1 U9.9)
P7.6: MCU (U3.59), SDCard (R21.2 U8.5)